# EAGLE design JurgenFolder (EAGLE 9.2.0)
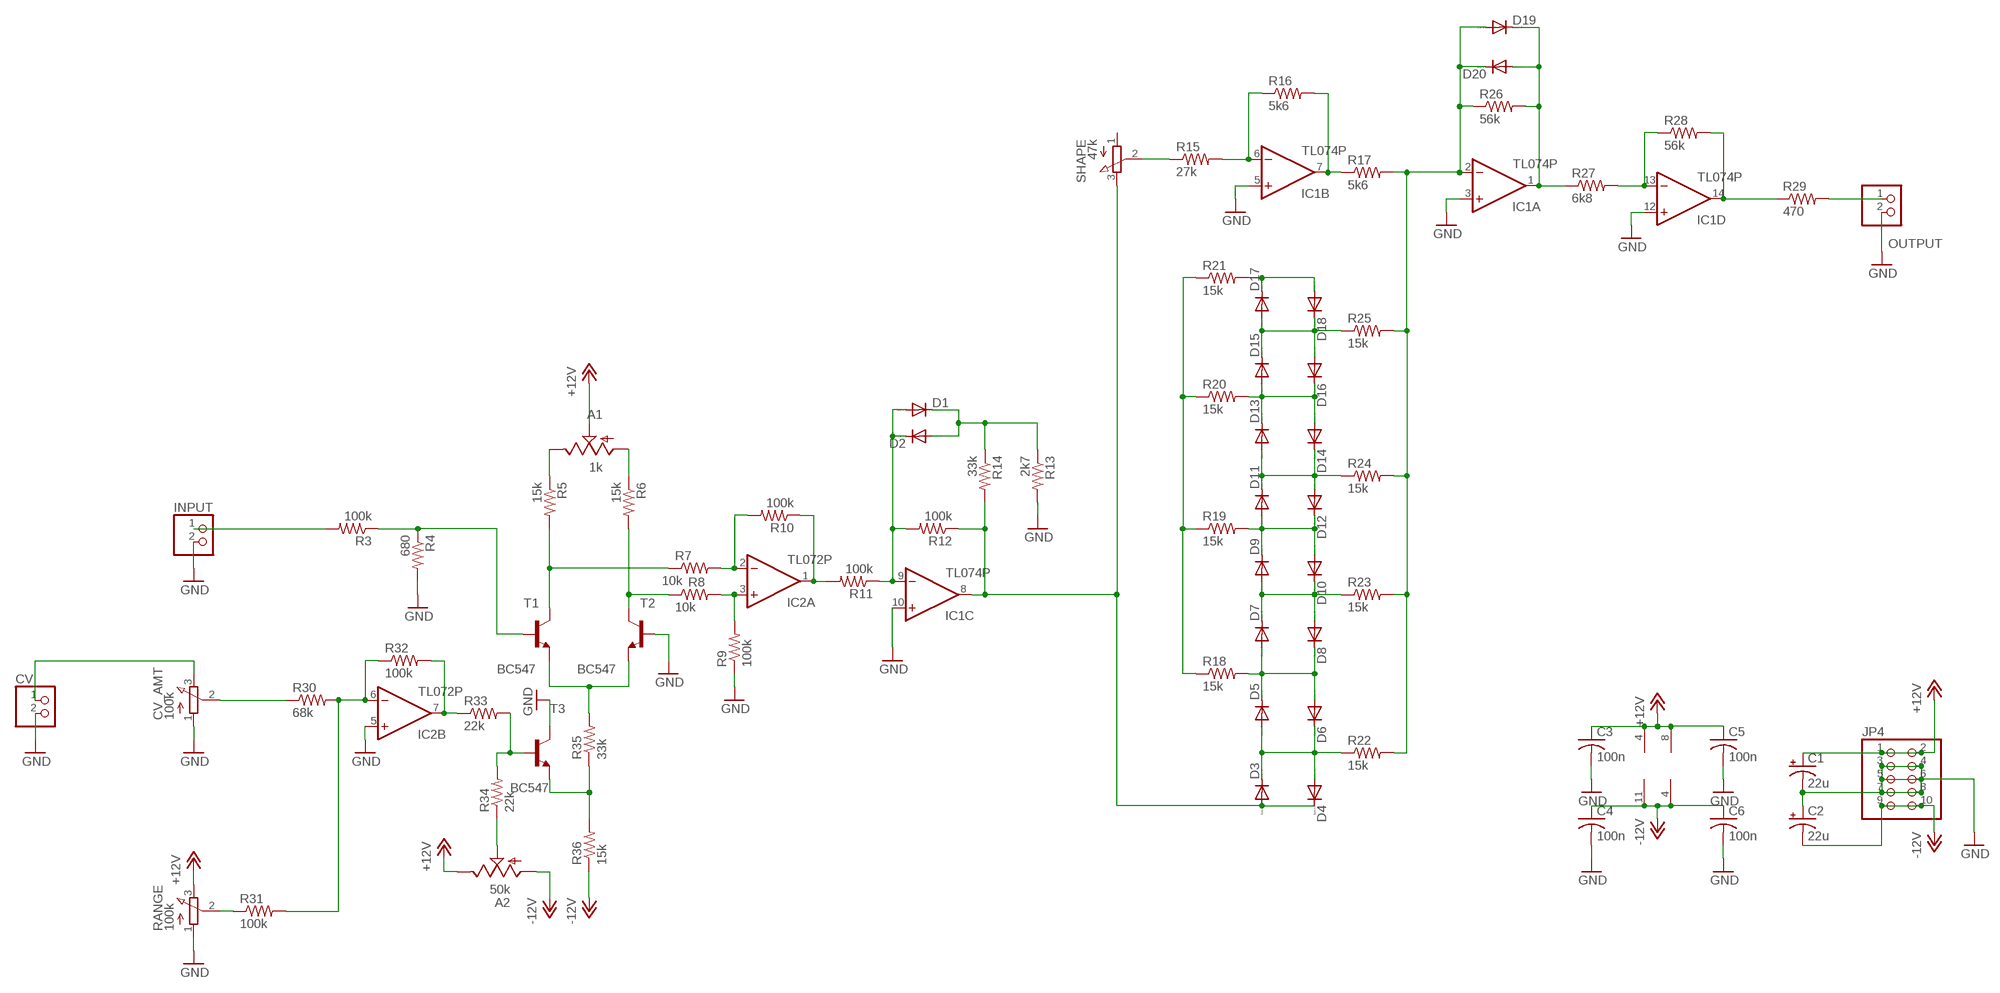
[diagram p0: schematic, sheet 1]

## Parts
A1  1k  TRIM_US-S64W  [S64W]
A2  50k  TRIM_US-S64W  [S64W]
C1  22u  CPOL-USE3.5-8  [E3,5-8]
C2  22u  CPOL-USE3.5-8  [E3,5-8]
C3  100n  C-US025-030X050  [C025-030X050]
C4  100n  C-US025-030X050  [C025-030X050]
C5  100n  C-US025-030X050  [C025-030X050]
C6  100n  C-US025-030X050  [C025-030X050]
CV  PINHD-1X2  [1X02]
CV_AMT  100k  3RP/1610N  [3RP/1610N]
D1  1N4148DO35-7  [DO35-7]
D2  1N4148DO35-7  [DO35-7]
D3  1N4148DO35-7  [DO35-7]
D4  1N4148DO35-7  [DO35-7]
D5  1N4148DO35-7  [DO35-7]
D6  1N4148DO35-7  [DO35-7]
D7  1N4148DO35-7  [DO35-7]
D8  1N4148DO35-7  [DO35-7]
D9  1N4148DO35-7  [DO35-7]
D10  1N4148DO35-7  [DO35-7]
D11  1N4148DO35-7  [DO35-7]
D12  1N4148DO35-7  [DO35-7]
D13  1N4148DO35-7  [DO35-7]
D14  1N4148DO35-7  [DO35-7]
D15  1N4148DO35-7  [DO35-7]
D16  1N4148DO35-7  [DO35-7]
D17  1N4148DO35-7  [DO35-7]
D18  1N4148DO35-7  [DO35-7]
D19  1N4148DO35-7  [DO35-7]
D20  1N4148DO35-7  [DO35-7]
IC1  TL074P  [DIL14]
IC2  TL072P  [DIL08]
INPUT  PINHD-1X2  [1X02]
JP4  PINHD-2X5  [2X05]
OUTPUT  PINHD-1X2  [1X02]
R3  100k  R-US_0204/7  [0204/7]
R4  680  R-US_0204/7  [0204/7]
R5  15k  R-US_0204/7  [0204/7]
R6  15k  R-US_0204/7  [0204/7]
R7  10k  R-US_0204/7  [0204/7]
R8  10k  R-US_0204/7  [0204/7]
R9  100k  R-US_0204/7  [0204/7]
R10  100k  R-US_0204/7  [0204/7]
R11  100k  R-US_0204/7  [0204/7]
R12  100k  R-US_0204/7  [0204/7]
R13  2k7  R-US_0204/7  [0204/7]
R14  33k  R-US_0204/7  [0204/7]
R15  27k  R-US_0204/7  [0204/7]
R16  5k6  R-US_0204/7  [0204/7]
R17  5k6  R-US_0204/7  [0204/7]
R18  15k  R-US_0204/7  [0204/7]
R19  15k  R-US_0204/7  [0204/7]
R20  15k  R-US_0204/7  [0204/7]
R21  15k  R-US_0204/7  [0204/7]
R22  15k  R-US_0204/7  [0204/7]
R23  15k  R-US_0204/7  [0204/7]
R24  15k  R-US_0204/7  [0204/7]
R25  15k  R-US_0204/7  [0204/7]
R26  56k  R-US_0204/7  [0204/7]
R27  6k8  R-US_0204/7  [0204/7]
R28  56k  R-US_0204/7  [0204/7]
R29  470  R-US_0204/7  [0204/7]
R30  68k  R-US_0204/7  [0204/7]
R31  100k  R-US_0204/7  [0204/7]
R32  100k  R-US_0204/7  [0204/7]
R33  22k  R-US_0204/7  [0204/7]
R34  22k  R-US_0204/7  [0204/7]
R35  33k  R-US_0204/7  [0204/7]
R36  15k  R-US_0204/7  [0204/7]
RANGE  100k  3RP/1610N  [3RP/1610N]
SHAPE  47k  3RP/1610N  [3RP/1610N]
T1  BC547  [TO92]
T2  BC547  [TO92]
T3  BC547  [TO92]

## Nets
+12V: A1.S A2.E C1.+ C3.1 C5.1 IC1.4(P:V+) IC2.8(P:V+) JP4.1 JP4.2 RANGE.3(E)
-12V: A2.A C2.- C4.1 C6.1 IC1.11(P:V-) IC2.4(P:V-) JP4.9 JP4.10 R36.1
GND: C1.- C2.+ C3.2 C4.2 C5.2 C6.2 CV.2 CV_AMT.1(A) IC1.3(A:+IN) IC1.5(B:+IN) IC1.10(C:+IN) IC1.12(D:+IN) IC2.5(B:+IN) INPUT.2 JP4.3 JP4.4 JP4.5 JP4.6 JP4.7 JP4.8 OUTPUT.2 R4.2 R9.1 R13.2 RANGE.1(A) T2.2(B) T3.3(C)
N$1: INPUT.1 R3.2
N$2: R3.1 R4.1 T1.2(B)
N$3: IC2.2(A:-IN) R7.2 R10.2
N$4: R5.2 R7.1 T1.3(C)
N$5: A1.E R5.1
N$6: A1.A R6.1
N$7: R6.2 R8.1 T2.3(C)
N$8: R35.2 T1.1(E) T2.1(E)
N$9: IC2.3(A:+IN) R8.2 R9.2
N$10: D3.A D4.C IC1.8(C:OUT) R12.1 R14.2 SHAPE.3(E)
N$11: IC2.1(A:OUT) R10.1 R11.2
N$12: D1.A D2.C IC1.9(C:-IN) R11.1 R12.2
N$13: R15.1 SHAPE.2(S)
N$14: D13.C D14.A D15.A D16.C R20.2
N$15: D1.C D2.A R13.1 R14.1
N$17: IC2.6(B:-IN) R30.2 R31.2 R32.1
N$18: CV_AMT.2(S) R30.1
N$19: IC1.6(B:-IN) R15.2 R16.1
N$20: IC2.7(B:OUT) R32.2 R33.1
N$21: R31.1 RANGE.2(S)
N$22: A2.S R34.1
N$23: R33.2 R34.2 T3.2(B)
N$24: R35.1 R36.2 T3.1(E)
N$25: OUTPUT.1 R29.2
N$26: IC1.7(B:OUT) R16.2 R17.1
N$27: D19.A D20.C IC1.2(A:-IN) R17.2 R22.2 R23.2 R24.2 R25.2 R26.1
N$28: D19.C D20.A IC1.1(A:OUT) R26.2 R27.1
N$29: D15.C D16.A D17.A D18.C R25.1
N$30: D11.C D12.A D13.A D14.C R24.1
N$31: D9.C D10.A D11.A D12.C R19.2
N$32: D7.C D8.A D9.A D10.C R23.1
N$33: D5.C D6.A D7.A D8.C R18.2
N$34: D3.C D4.A D5.A D6.C R22.1
N$35: D17.C D18.A R21.2
N$36: IC1.13(D:-IN) R27.2 R28.1
N$37: R18.1 R19.1 R20.1 R21.1
N$38: CV.1 CV_AMT.3(E)
N$39: IC1.14(D:OUT) R28.2 R29.1
Unconnected: SHAPE.1(A)

## Library data of the parts
A1 A2 = pot:TRIM_US-: POTENTIOMETER
C1 C2 = rcl:CPOL-US: POLARIZED CAPACITOR, American symbol; SPICEPREFIX: C
C3-C6 = rcl:C-US: CAPACITOR, American symbol; SPICEPREFIX: C
CV INPUT OUTPUT = pinhead:PINHD-1X2: PIN HEADER
CV_AMT RANGE SHAPE = pot:3RP/1610N: 16mm Potentiometer one level Source: http://www.alphapotentiometers.net/html/16mm_pot_2.html
D1-D20 = diode:1N4148: DIODE high speed (Philips)
IC1 = linear:TL074: OP AMP
IC2 = linear:TL072: OP AMP
JP4 = pinhead:PINHD-2X5: PIN HEADER
R3-R36 = rcl:R-US_: RESISTOR, American symbol; SPICEPREFIX: R
T1-T3 = transistor:BC547: NPN TRANSISTOR

## Board
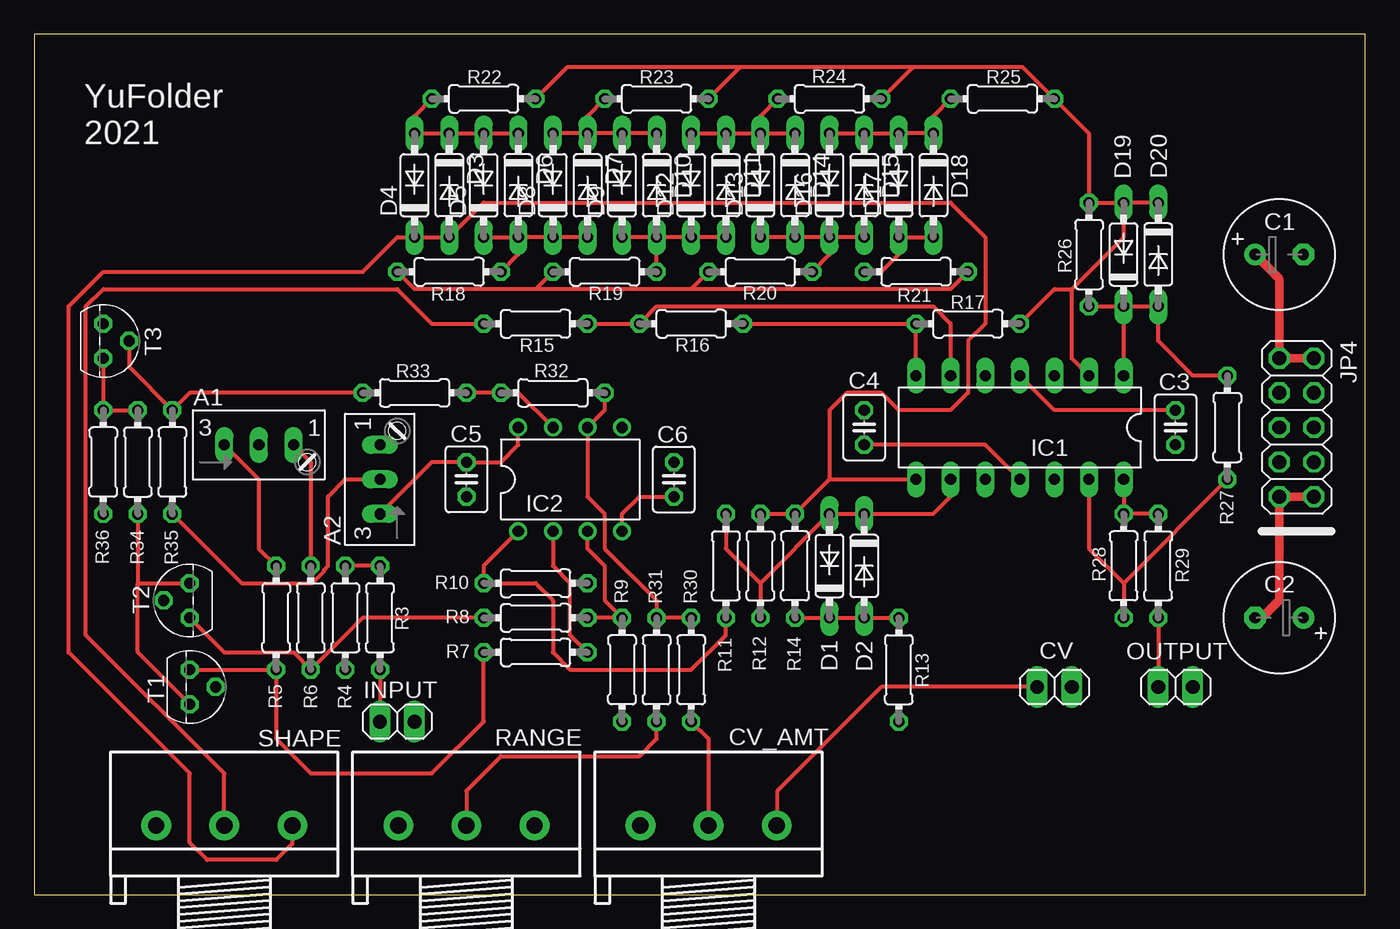
[diagram p1: board, top side]
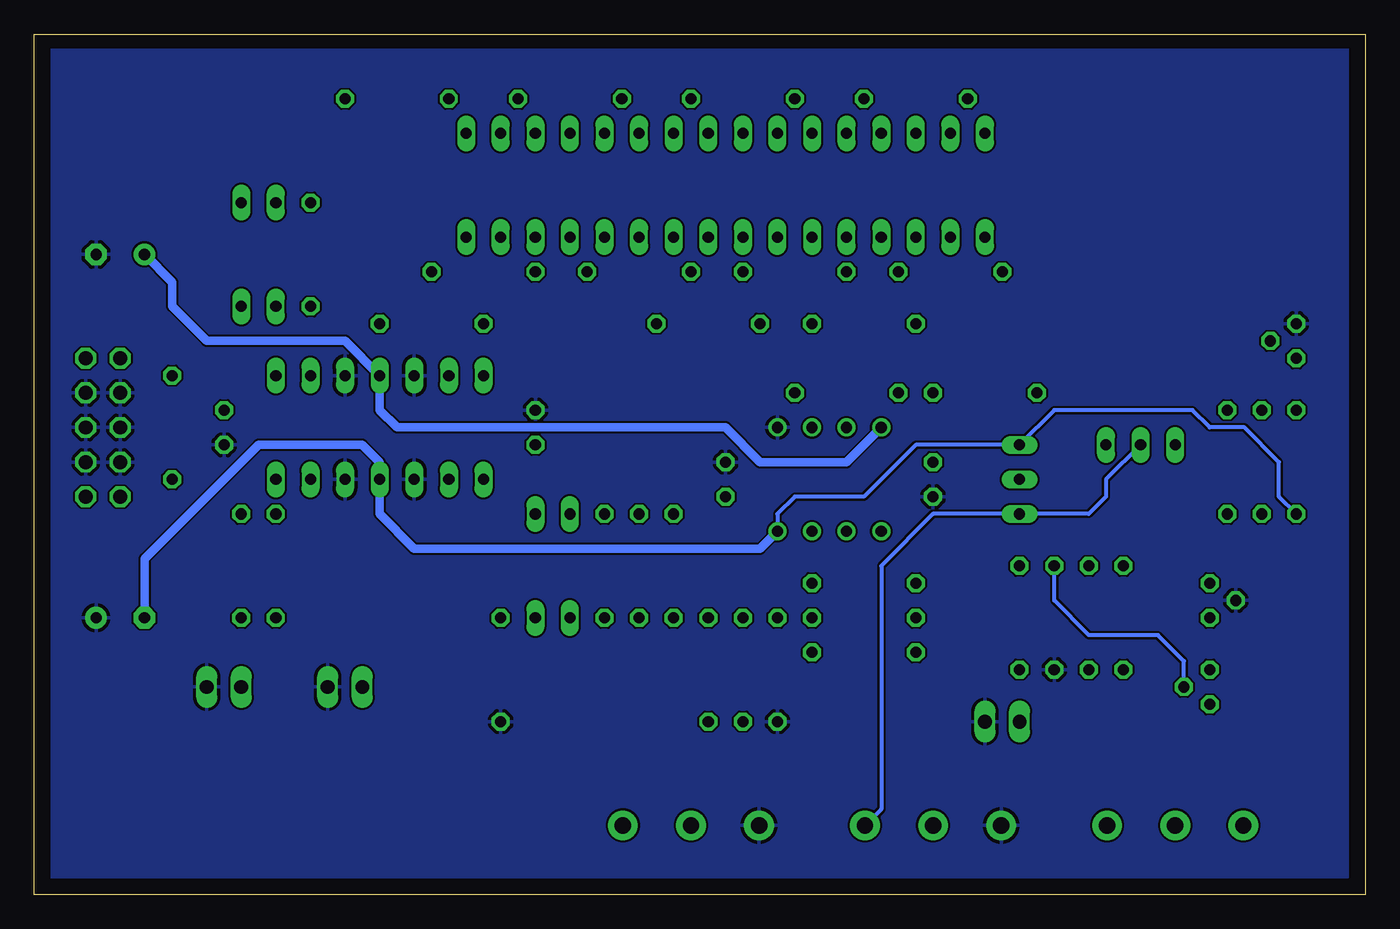
[diagram p2: board, bottom side, seen from below]

Size 97.77 x 63.17 mm. Coordinates in mm from the lower left corner, seen from the top.
Outline: 0,0 97.77,0 97.77,63.17 0,63.17 0,0
Copper layers (1*16): Top 0.035mm / dielectric 1.5mm / Bottom 0.035mm
Design rules "default": minimum track width 6mil, minimum drill 0.35mm, track to track 6mil, track to pad 6mil, pad to pad 6mil, via to via 6mil, smd to smd 6mil, copper to edge 40mil, drill to drill 6mil, minimum pad ring 10mil, minimum via ring 8mil, stop-mask expansion 4mil, vias tented up to drill 0mil, thermal gap 10mil

### Footprints (pad centres in the part's own frame; a part is rotated, then mirrored left to right if it is on the bottom)
S64W = drill 0.813 long: A 2.54,1.27; E -2.54,1.27; S 0,1.27
E3,5-8 = drill 0.813 pad 1.6: + -1.778,0 | drill 0.813 pad 1.6 octagon: - 1.778,0
C025-030X050 = drill 0.813 octagon: 1 -1.27,0; 2 1.27,0
1X02 = drill 1.016 long: 1 -1.27,0; 2 1.27,0
3RP/1610N = drill 1.2 pad 2.184: 1 -5,0; 2 0,0; 3 5,0
DO35-7 = drill 0.813 long: A 3.81,0; C -3.81,0
DIL14 = drill 0.813 long: 1 -7.62,-3.81; 2 -5.08,-3.81; 3 -2.54,-3.81; 4 0,-3.81; 5 2.54,-3.81; 6 5.08,-3.81; 7 7.62,-3.81; 8 7.62,3.81; 9 5.08,3.81; 10 2.54,3.81; 11 0,3.81; 12 -2.54,3.81; 13 -5.08,3.81; 14 -7.62,3.81
DIL08 = drill 0.813 pad 1.27: 1 -3.81,-3.81; 2 -1.27,-3.81; 3 1.27,-3.81; 4 3.81,-3.81; 5 3.81,3.81; 6 1.27,3.81; 7 -1.27,3.81; 8 -3.81,3.81
2X05 = drill 1.016 octagon: 1 -5.08,-1.27; 2 -5.08,1.27; 3 -2.54,-1.27; 4 -2.54,1.27; 5 0,-1.27; 6 0,1.27; 7 2.54,-1.27; 8 2.54,1.27; 9 5.08,-1.27; 10 5.08,1.27
0204/7 = drill 0.813 octagon: 1 -3.81,0; 2 3.81,0
TO92 = drill 0.813 octagon: 1 1.27,0; 2 0,1.905; 3 -1.27,0

### Placement (x,y rotation side)
A1  16.51,31.75 0 top
A2  26.67,30.48 90 top
C1  91.44,46.99 0 top
C2  91.44,20.32 180 top
C3  83.82,34.29 270 top
C4  60.96,34.29 90 top
C5  31.75,30.48 270 top
C6  46.99,30.48 90 top
CV  74.93,15.24 0 top
CV_AMT  49.53,5.08 0 top
D1  58.42,24.13 90 top
D2  60.96,24.13 270 top
D3  30.48,52.07 270 top
D4  27.94,52.07 90 top
D5  33.02,52.07 90 top
D6  35.56,52.07 270 top
D7  40.64,52.07 270 top
D8  38.1,52.07 90 top
D9  43.18,52.07 90 top
D10  45.72,52.07 270 top
D11  50.8,52.07 270 top
D12  48.26,52.07 90 top
D13  53.34,52.07 90 top
D14  55.88,52.07 270 top
D15  60.96,52.07 270 top
D16  58.42,52.07 90 top
D17  63.5,52.07 90 top
D18  66.04,52.07 270 top
D19  80.01,46.99 90 top
D20  82.55,46.99 270 top
IC1  72.39,34.29 180 top
IC2  39.37,30.48 0 top
INPUT  26.67,12.7 0 top
JP4  92.71,34.29 270 top
OUTPUT  83.82,15.24 0 top
R3  25.4,20.32 270 top
R4  22.86,20.32 270 top
R5  17.78,20.32 270 top
R6  20.32,20.32 270 top
R7  36.83,17.78 0 top
R8  36.83,20.32 0 top
R9  43.18,16.51 90 top
R10  36.83,22.86 0 top
R11  50.8,24.13 270 top
R12  53.34,24.13 270 top
R13  63.5,16.51 270 top
R14  55.88,24.13 90 top
R15  36.83,41.91 0 top
R16  48.26,41.91 0 top
R17  68.58,41.91 0 top
R18  30.48,45.72 0 top
R19  41.91,45.72 0 top
R20  53.34,45.72 0 top
R21  64.77,45.72 180 top
R22  33.02,58.42 0 top
R23  45.72,58.42 0 top
R24  58.42,58.42 0 top
R25  71.12,58.42 0 top
R26  77.47,46.99 270 top
R27  87.63,34.29 270 top
R28  80.01,24.13 90 top
R29  82.55,24.13 270 top
R30  48.26,16.51 90 top
R31  45.72,16.51 90 top
R32  38.1,36.83 180 top
R33  27.94,36.83 180 top
R34  10.16,31.75 90 top
R35  7.62,31.75 270 top
R36  5.08,31.75 90 top
RANGE  31.75,5.08 0 top
SHAPE  13.97,5.08 0 top
T1  11.43,15.24 270 top
T2  11.43,21.59 90 top
T3  5.08,40.64 270 top

### Tracks (layer width: path | path; a pad name or v marks a point on that pad's centre or on a via)
+12V
  Top 0.305: IC1.4 74.93,35.56 C3.1 | IC2.8 35.56,33.02 34.29,31.75 C5.1 29.21,31.75 A2.E
  Top 0.61: C1.+ 91.44,45.21 JP4.1 JP4.2
  Bottom 0.305: A1.S 19.05,30.48 19.05,29.21 20.32,27.94 A2.E 31.75,27.94 35.56,24.13 35.56,6.27 RANGE.3
  Bottom 0.61: C1.+ 87.63,44.96 87.63,43.18 85.09,40.64 74.93,40.64 IC1.4 72.39,35.56 71.12,34.29 46.99,34.29 44.45,31.75 38.1,31.75 IC2.8
-12V
  Top 0.305: IC1.11 69.85,33.02 C4.1 | IC2.4 43.18,27.94 44.45,29.21 C6.1
  Top 0.61: C2.- 90.17,20.32 91.44,21.59 JP4.9 JP4.10
  Bottom 0.305: R36.1 6.35,29.21 6.35,31.75 8.89,34.29 11.43,34.29 12.7,35.56 22.86,35.56 A2.A 33.02,33.02 36.83,29.21 41.91,29.21 43.18,27.94 IC2.4
  Bottom 0.61: C2.- 89.66,24.64 81.28,33.02 73.66,33.02 72.39,31.75 IC1.11 72.39,27.94 69.85,25.4 44.45,25.4 IC2.4
GND
  pour Bottom: 1.27,1.27 1.27,62.23 96.52,62.23 96.52,1.27
N$1
  Top 0.305: R3.2 INPUT.1
N$2
  Top 0.305: R3.1 R4.1
  Bottom 0.305: T1.2 13.33,17.14 15.24,19.05 20.32,19.05 22.86,21.59 R4.1
N$3
  Top 0.305: IC2.2 38.1,24.13 39.37,22.86 | R10.2 39.37,22.86 | R7.2 39.37,19.05 39.37,22.86
N$4
  Top 0.305: T1.3 R5.2 17.78,11.43 20.32,8.89 29.21,8.89 33.02,12.7 R7.1
N$5
  Top 0.305: A1.E 16.51,30.48 16.51,25.4 R5.1
N$6
  Top 0.305: A1.A 20.32,31.75 R6.1
N$7
  Top 0.305: T2.3 13.97,17.78 19.05,17.78 R6.2 24.13,20.32 R8.1
N$8
  Top 0.305: T1.1 7.62,17.78 7.62,22.86 | 7.62,22.86 T2.1 | R35.2 7.62,22.86
N$9
  Top 0.305: R8.2 R9.2 41.91,21.59 41.91,24.13 40.64,25.4 IC2.3
N$10
  Top 0.305: R12.1 R14.2 58.42,30.48 | 58.42,30.48 IC1.8 | 58.42,30.48 58.42,35.56 59.69,36.83 62.23,36.83 63.5,35.56 67.31,35.56 68.58,36.83 68.58,40.64 69.85,41.91 69.85,48.26 67.31,50.8 33.02,50.8 D3.A D4.C 26.67,48.26 24.13,45.72 5.08,45.72 2.54,43.18 2.54,17.78 11.43,8.89 11.43,3.81 12.7,2.54 17.78,2.54 18.97,3.73 SHAPE.3
N$11
  Top 0.305: IC2.1 33.02,24.13 R10.1 36.83,22.86 38.1,21.59 38.1,17.78 39.37,16.51 48.26,16.51 50.8,19.05 R11.2
N$12
  Top 0.305: R11.1 50.8,25.4 53.34,22.86 | 53.34,22.86 R12.2 | 53.34,22.86 D1.A D2.C 66.04,27.94 67.31,29.21 IC1.9
N$13
  Top 0.305: SHAPE.2 13.97,8.89 3.81,19.05 3.81,43.18 5.08,44.45 26.67,44.45 29.21,41.91 R15.1
N$14
  Top 0.305: D15.A D16.C | D16.C D14.A D13.C | R20.2 58.42,46.99 D16.C
N$15
  Top 0.305: R14.1 D1.C D2.A R13.1
N$17
  Top 0.305: R32.1 41.91,35.56 IC2.6 40.64,29.21 41.91,27.94 41.91,25.4 45.72,21.59 R31.2 R30.2
N$18
  Top 0.305: R30.1 49.53,11.43 CV_AMT.2
N$19
  Top 0.305: IC1.6 67.31,41.91 66.04,43.18 45.72,43.18 R16.1 R15.2
N$20
  Top 0.305: R33.1 R32.2 35.56,36.83 IC2.7
N$21
  Top 0.305: RANGE.2 31.75,7.62 34.29,10.16 44.45,10.16 45.72,11.43 R31.1
N$22
  Top 0.305: R34.1 15.24,22.86 20.41,22.86 21.29,23.73 21.29,23.83 21.59,24.13 21.59,29.21 22.86,30.48 A2.S
N$23
  Top 0.305: T3.2 6.99,38.73 R34.2 11.43,36.83 R33.2
N$24
  Top 0.305: R35.1 R36.2 T3.1
N$25
  Top 0.305: R29.2 OUTPUT.1
N$26
  Top 0.305: IC1.7 R17.1 R16.2
N$27
  Top 0.305: IC1.2 76.2,39.37 76.2,44.45 | 76.2,44.45 80.01,48.26 D19.A | D20.C D19.A | D19.A R26.1 77.47,55.88 R25.2 72.62,60.73 64.54,60.73 | R17.2 74.93,44.45 76.2,44.45 | 64.54,60.73 R24.2 | 51.84,60.73 R23.2 | 64.54,60.73 51.84,60.73 | R22.2 39.14,60.73 51.84,60.73
N$28
  Top 0.305: IC1.1 D19.C | D19.C D20.A 82.55,40.64 85.09,38.1 R27.1 | R26.2 D19.C
N$29
  Top 0.305: D16.A D15.C D17.A D18.C 66.04,57.15 R25.1
N$30
  Top 0.305: D12.A D11.C D13.A | D13.A D14.C | R24.1 53.34,57.15 D13.A
N$31
  Top 0.305: D11.A D12.C D10.A | D10.A D9.C | R19.2 D10.A
N$32
  Top 0.305: D10.C D9.A D7.C | D7.C D8.A | R23.1 40.64,57.15 D7.C
N$33
  Top 0.305: D7.A D8.C D6.A | D5.C D6.A | R18.2 35.56,46.99 D6.A
N$34
  Top 0.305: D6.C D5.A D3.C D4.A 27.94,57.15 R22.1
N$35
  Top 0.305: D18.A D17.C 63.5,46.99 62.23,45.72 R21.2
N$36
  Top 0.305: IC1.13 77.47,25.4 80.01,22.86 | 80.01,22.86 R28.1 | R27.2 80.01,22.86
N$37
  Top 0.305: R20.1 48.26,44.45 | R19.1 36.83,44.45 | 36.83,44.45 27.94,44.45 R18.1 | R21.1 67.31,44.45 48.26,44.45 | 48.26,44.45 36.83,44.45
N$38
  Top 0.305: CV_AMT.3 54.61,5.16 54.61,7.62 62.23,15.24 CV.1
N$39
  Top 0.305: IC1.14 R28.2 R29.1

### Text on the board
tNames: YuFolder / 2021